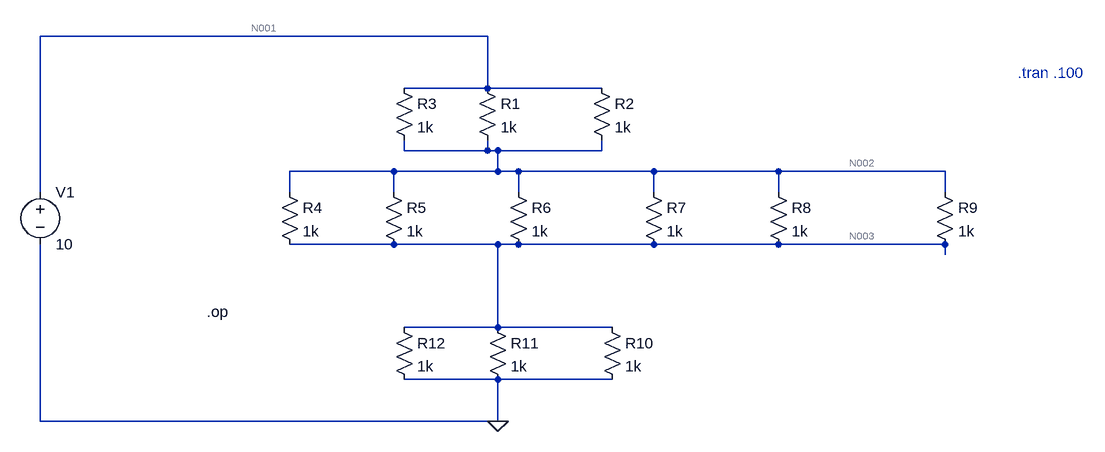
[diagram p0: schematic Draft4.asc]
Draft4.asc, the LTspice schematic file:
Version 4.1
SHEET 1 1124 680
WIRE 192 -16 -496 -16
WIRE 192 64 192 -16
WIRE 192 64 64 64
WIRE 368 64 192 64
WIRE 64 160 64 144
WIRE 192 160 192 144
WIRE 192 160 64 160
WIRE 208 160 192 160
WIRE 368 160 368 144
WIRE 368 160 208 160
WIRE 48 192 -112 192
WIRE 208 192 208 160
WIRE 208 192 48 192
WIRE 240 192 208 192
WIRE 448 192 240 192
WIRE 640 192 448 192
WIRE 896 192 640 192
WIRE -496 224 -496 -16
WIRE -112 224 -112 192
WIRE 48 224 48 192
WIRE 240 224 240 192
WIRE 448 224 448 192
WIRE 640 224 640 192
WIRE 896 224 896 192
WIRE 48 304 -112 304
WIRE 208 304 48 304
WIRE 240 304 208 304
WIRE 448 304 240 304
WIRE 640 304 448 304
WIRE 896 304 640 304
WIRE 896 320 896 304
WIRE 208 432 208 304
WIRE 208 432 64 432
WIRE 384 432 208 432
WIRE 208 512 64 512
WIRE 384 512 208 512
WIRE -496 576 -496 304
WIRE 208 576 208 512
WIRE 208 576 -496 576
FLAG 208 576 0
DATAFLAG 192 32 ""
DATAFLAG 208 176 ""
DATAFLAG 208 320 ""
DATAFLAG 208 512 ""
SYMBOL res 176 48 R0
SYMATTR InstName R1
SYMATTR Value 1k
SYMBOL res 352 48 R0
SYMATTR InstName R2
SYMATTR Value 1k
SYMBOL res 48 48 R0
SYMATTR InstName R3
SYMATTR Value 1k
SYMBOL res -128 208 R0
SYMATTR InstName R4
SYMATTR Value 1k
SYMBOL res 32 208 R0
SYMATTR InstName R5
SYMATTR Value 1k
SYMBOL res 224 208 R0
SYMATTR InstName R6
SYMATTR Value 1k
SYMBOL res 432 208 R0
SYMATTR InstName R7
SYMATTR Value 1k
SYMBOL res 624 208 R0
SYMATTR InstName R8
SYMATTR Value 1k
SYMBOL res 880 208 R0
SYMATTR InstName R9
SYMATTR Value 1k
SYMBOL res 368 416 R0
SYMATTR InstName R10
SYMATTR Value 1k
SYMBOL res 192 416 R0
SYMATTR InstName R11
SYMATTR Value 1k
SYMBOL res 48 416 R0
SYMATTR InstName R12
SYMATTR Value 1k
SYMBOL voltage -496 208 R0
WINDOW 123 0 0 Left 0
WINDOW 39 0 0 Left 0
SYMATTR InstName V1
SYMATTR Value 10
TEXT 1008 40 Left 2 ;.tran .100
TEXT -240 408 Left 2 !.op

The netlist it stands for:
* Draft4.asc
R1 N001 N002 1k
R2 N001 N002 1k
R3 N001 N002 1k
R4 N002 N003 1k
R5 N002 N003 1k
R6 N002 N003 1k
R7 N002 N003 1k
R8 N002 N003 1k
R9 N002 N003 1k
R10 N003 0 1k
R11 N003 0 1k
R12 N003 0 1k
V1 N001 0 10
* .tran .100
.op
.backanno
.end

* Results of the author's LTspice run, read from the files saved beside the schematic
* Operating Point:
*   V(n002) = 6 V
*   V(n001) = 10 V
*   V(n003) = 4 V
*   I(R3) = 4 mA
*   I(R5) = 2 mA
*   I(R6) = 2 mA
*   I(R8) = 2 mA
*   I(R11) = 4 mA
*   I(V1) = -12 mA
*   I(R1) = 4 mA
*   I(R2) = 4 mA
*   I(R4) = 2 mA
*   I(R7) = 2 mA
*   I(R9) = 2 mA
*   I(R10) = 4 mA
*   I(R12) = 4 mA